# Altium schematic sheet Buttons.SchDoc: Buttons
size A; Date: Not used; ApprovedBy: Not used; CheckedBy: Not used; Author: Not used; CompanyName: STMicroelectronics; DrawnBy: Not used; Engineer: Not used; Organization: Not used; Address1: Not used; Address2: Not used; Address3: Not used; Address4: Not used; DocumentNumber: Not used; Revision: 1.0.0; SheetNumber: 4; SheetTotal: 6; CurrentTime: Not used; CurrentDate: Not used; Time: Not used; DocumentFullPathAndName: Not used; DocumentName: Not used; ModifiedDate: Not used; ImagePath: Not used; ProjectName: Not used; Application_BuildNumber: Not used
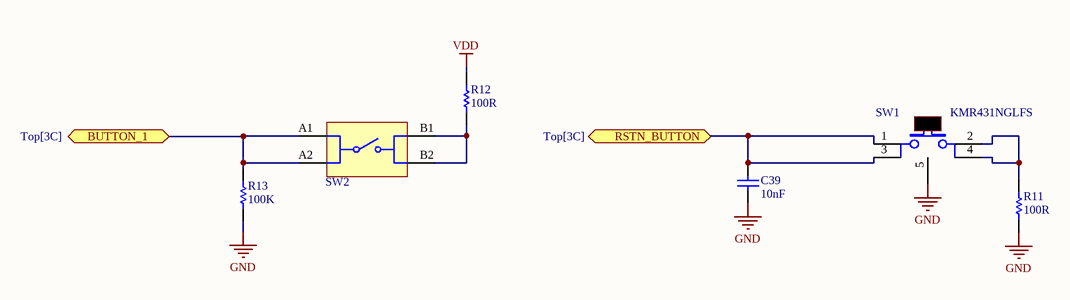
[diagram p0: Buttons.SchDoc]

## Parts
C39  value 10nF  [C0402]  (hidden comment: Capacitor)
R11  value 100R  [R0402]  (hidden comment: Resistor)
R12  value 100R  [R0402]  (hidden comment: Resistor)
R13  value 100K  [R0402]  (hidden comment: Resistor)
SW1  value KMR431NGLFS  [SWI_C&K_Y78B23110FP__ITT_KMR231GLFS]  (hidden comment: SW-PUSH-CMS_BLACK_PIN1-3_2-4)
SW2  434351045816  [434351045816]  (value not drawn)

## Ports
BUTTON_1 (bidir, see Top[3C]), RSTN_BUTTON (bidir, see Top[3C])

## Nets
GND: C39.1 R11.1 R13.1 SW1.5(GND)
VDD: R12.2
BUTTON_1: R13.2 SW2.A1 SW2.A2 ; port BUTTON_1
RSTN_BUTTON: C39.2 SW1.1 SW1.3 ; port RSTN_BUTTON
NetR11_2: R11.2 SW1.2 SW1.4
NetR12_1: R12.1 SW2.B1 SW2.B2

## Notes on the sheet
- Title:
- Size:
- Date:
- A
- Revision:
- Sheet
- of
- File:

## Library data of the parts
C39 = MCD-00011: Capacitor, MLCC, 10nF, 16V, X7R, +/-10%, 0402, T=0.5mm; Part_Preference: Recommended; Manufacturer: YAGEO; Manufacturer_Part_Number: CC0402KRX7R7BB103; Order_Code_RS: 3019275; Component_Country_Of_Origin: China; ShowFields: YES; ID: 2469; Internal_Part_Number: MCD-00011; Status: Released; Part_Type: Capacitor; Package: 0402; ComponentLink1URL: http://tunmcdsvn.tun.st.com/Component_Documentation_Library/Trunk/Capacitor/YAGEO_X7R_Series; Order_Code_Digikey: 311-1042-1-ND; Order_Code_Farnell: 3019275; Manufacturer Part Number: CC0402KRX7R7BB103
R11 R12 = MCD-02655: Resistor, 100R, 0402, +/-0.1%, 1/16W, +/-25ppm/°C; Part_Preference: Recommended; Manufacturer: YAGEO; Manufacturer_Part_Number: RT0402BRD07100RL; Order_Code_RS: 199-1268; Component_Country_Of_Origin: China; ShowFields: YES; ID: 4761; Internal_Part_Number: MCD-02655; Status: Checked; Part_Type: Resistor; Package: 0402; ComponentLink1URL: http://tunmcdsvn.tun.st.com/Component_Documentation_Library/Trunk/Resistor/YAGEO_RT_Series; Order_Code_Digikey: YAG2301TR-ND; Order_Code_Farnell: 3496479RL; Manufacturer Part Number: RT0402BRD07100RL
R13 = MCD-00059: Resistor, 100K, 0402, +/-1%, 1/16W; Part_Preference: Recommended; Manufacturer: YAGEO; Manufacturer_Part_Number: RC0402FR-07100KL; Partial_Alternate_Internal_Part_Number: MCD-03301; Order_Code_RS: 2421891; Component_Country_Of_Origin: China; ShowFields: YES; ID: 2533; Internal_Part_Number: MCD-00059; Status: Released; Part_Type: Resistor; Package: 0402; ComponentLink1URL: http://tunmcdsvn.tun.st.com/Component_Documentation_Library/Trunk/Resistor/YAGEO_RC_L_Series; Order_Code_Digikey: 311-100KLRTR-ND; Order_Code_Farnell: 2421891; Manufacturer Part Number: RC0402FR-07100KL
SW1 = MCD-00715: Switch tactile, SPST-NO, 32V, 50mA, 2.8x4.6mm; Part_Type: Misc; Part_Preference: Recommended; Manufacturer: C&K; Manufacturer Part Number: Y78B23110FP; Component_Country_Of_Origin: France; ShowFields: YES; ID: 3028; Internal_Part_Number: MCD-00715; Status: Checked; Manufacturer_Part_Number: KMR431NGLFS; Package: 2.8x4.6mm; ComponentLink1URL: http://tunmcdsvn.tun.st.com/Component_Documentation_Library/Trunk/Misc/C&K_Y78B23110FP; Order_Code_Digikey: 401-1429-2-ND; Order_Code_Farnell: N/A; Order_Code_RS: N/A
SW2 = 434351045816: WS-TASU SMT Tact Switch 4.7x3.5mm side push, SPST-NO, 12VDC, 50mA, 160g; Manufacturer: Wurth Elektronik; Washable: No; ComponentLink1Description: Website Link; ComponentLink1URL: https://www.we-online.com/redexpert/article/434351045816?ad; ComponentLink2Description: Datasheet Link; ComponentLink2URL: https://www.we-online.com/redexpert/spec/434351045816?ad; Manufacturer Part Number: 434351045816; Category: Tact Switches; Match Code: WS-TASU; Mount: Surface Mount; Operating Temperature Max: 85°C; Operating Temperature Min: -40°C; Packaging: Tape and Reel; Length: 4.7mm; Width: 3.5mm; Height: 1.65mm; Circuit: SPST-NO; Contact Material: Stainless Steel; Contact Plating: Silver; Operation Force: 160g; Rated Current: 50mA; Rated Voltage: 12VDC; Terminal Material: Copper Alloy; Terminal Plating: Silver